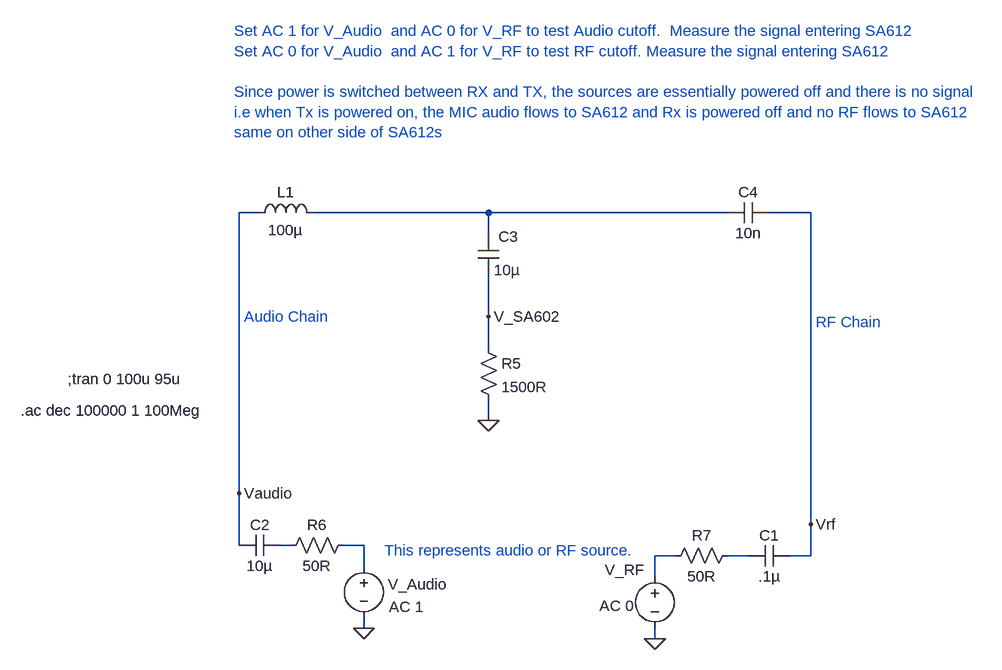
[diagram p0: schematic No Switch Test.asc]
No Switch Test.asc, the LTspice schematic file:
Version 4
SHEET 1 1868 808
WIRE 192 -416 160 -416
WIRE 544 -416 272 -416
WIRE 912 -416 544 -416
WIRE 1040 -416 976 -416
WIRE 544 -384 544 -416
WIRE 544 -256 544 -320
WIRE 544 -208 544 -256
WIRE 544 -96 544 -128
WIRE 160 16 160 -416
WIRE 1040 64 1040 -416
WIRE 160 96 160 16
WIRE 240 96 224 96
WIRE 352 96 320 96
WIRE 832 112 800 112
WIRE 944 112 912 112
WIRE 1040 112 1040 64
WIRE 1040 112 1008 112
WIRE 352 128 352 96
WIRE 800 144 800 112
WIRE 352 224 352 208
WIRE 800 240 800 224
FLAG 352 224 0
FLAG 1040 64 Vrf
FLAG 160 16 Vaudio
FLAG 800 240 0
FLAG 544 -96 0
FLAG 544 -256 V_SA602
SYMBOL voltage 800 128 R0
WINDOW 3 -203 9 Left 2
WINDOW 123 -85 61 Left 2
WINDOW 39 0 0 Left 2
WINDOW 0 -77 6 Left 2
SYMATTR Value ""
SYMATTR Value2 AC 0
SYMATTR InstName V_RF
SYMBOL cap 1008 96 R90
WINDOW 0 0 32 VBottom 2
WINDOW 3 32 32 VTop 2
SYMATTR InstName C1
SYMATTR Value .1µ
SYMBOL cap 224 80 R90
WINDOW 0 0 32 VBottom 2
WINDOW 3 32 32 VTop 2
SYMATTR InstName C2
SYMATTR Value 10µ
SYMBOL voltage 352 112 R0
WINDOW 3 24 95 Left 2
WINDOW 123 39 79 Left 2
WINDOW 39 0 0 Left 2
WINDOW 0 37 44 Left 2
SYMATTR Value ""
SYMATTR Value2 AC 1
SYMATTR InstName V_Audio
SYMBOL ind 176 -400 R270
WINDOW 0 32 56 VTop 2
WINDOW 3 5 56 VBottom 2
SYMATTR InstName L1
SYMATTR Value 100µ
SYMBOL cap 528 -384 R0
WINDOW 0 31 5 Left 2
SYMATTR InstName C3
SYMATTR Value 10µ
SYMBOL res 528 -224 R0
SYMATTR InstName R5
SYMATTR Value 1500R
SYMBOL cap 976 -432 R90
WINDOW 0 0 32 VBottom 2
WINDOW 3 32 32 VTop 2
SYMATTR InstName C4
SYMATTR Value 10n
SYMBOL res 336 80 R90
WINDOW 0 0 56 VBottom 2
WINDOW 3 32 56 VTop 2
SYMATTR InstName R6
SYMATTR Value 50R
SYMBOL res 928 96 R90
WINDOW 0 0 56 VBottom 2
WINDOW 3 32 56 VTop 2
SYMATTR InstName R7
SYMATTR Value 50R
TEXT -104 -160 Left 2 !;tran 0 100u 95u
TEXT -176 -112 Left 2 !.ac dec 100000 1 100Meg
TEXT 168 -256 Left 2 ;Audio Chain
TEXT 1048 -248 Left 2 ;RF Chain
TEXT 152 -696 Left 2 ;Set AC 1 for V_Audio  and AC 0 for V_RF to test Audio cutoff.  Measure the signal entering SA612\nSet AC 0 for V_Audio  and AC 1 for V_RF to test RF cutoff. Measure the signal entering SA612\n \nSince power is switched between RX and TX, the sources are essentially powered off and there is no signal\ni.e when Tx is powered on, the MIC audio flows to SA612 and Rx is powered off and no RF flows to SA612\nsame on other side of SA612s
TEXT 384 104 Left 2 ;This represents audio or RF source.

The netlist it stands for:
* No Switch Test.asc
V_RF N004 0 AC 0
C1 Vrf N005 .1µ
C2 N002 Vaudio 10µ
V_Audio N003 0 AC 1
L1 Vaudio N001 100µ
C3 N001 V_SA602 10µ
R5 V_SA602 0 1500R
C4 Vrf N001 10n
R6 N003 N002 50R
R7 N005 N004 50R
;tran 0 100u 95u
.ac dec 100000 1 100Meg
* Audio Chain
* RF Chain
* Set AC 1 for V_Audio  and AC 0 for V_RF to test Audio cutoff.  Measure the signal entering SA612
* Set AC 0 for V_Audio  and AC 1 for V_RF to test RF cutoff. Measure the signal entering SA612
* Since power is switched between RX and TX, the sources are essentially powered off and there is no signal
* i.e when Tx is powered on, the MIC audio flows to SA612 and Rx is powered off and no RF flows to SA612
* same on other side of SA612s
* This represents audio or RF source.
.backanno
.end